# Altium schematic sheet LPDDR4X SDRAM.SchDoc: AS4C1G32MD4V-046BIN
size A4 portrait; DrawnBy: ThanhQuoc; Revision: V01; SheetNumber: 8; SheetTotal: 21; Project: RV1126 CAMERA BOARD DESIGN
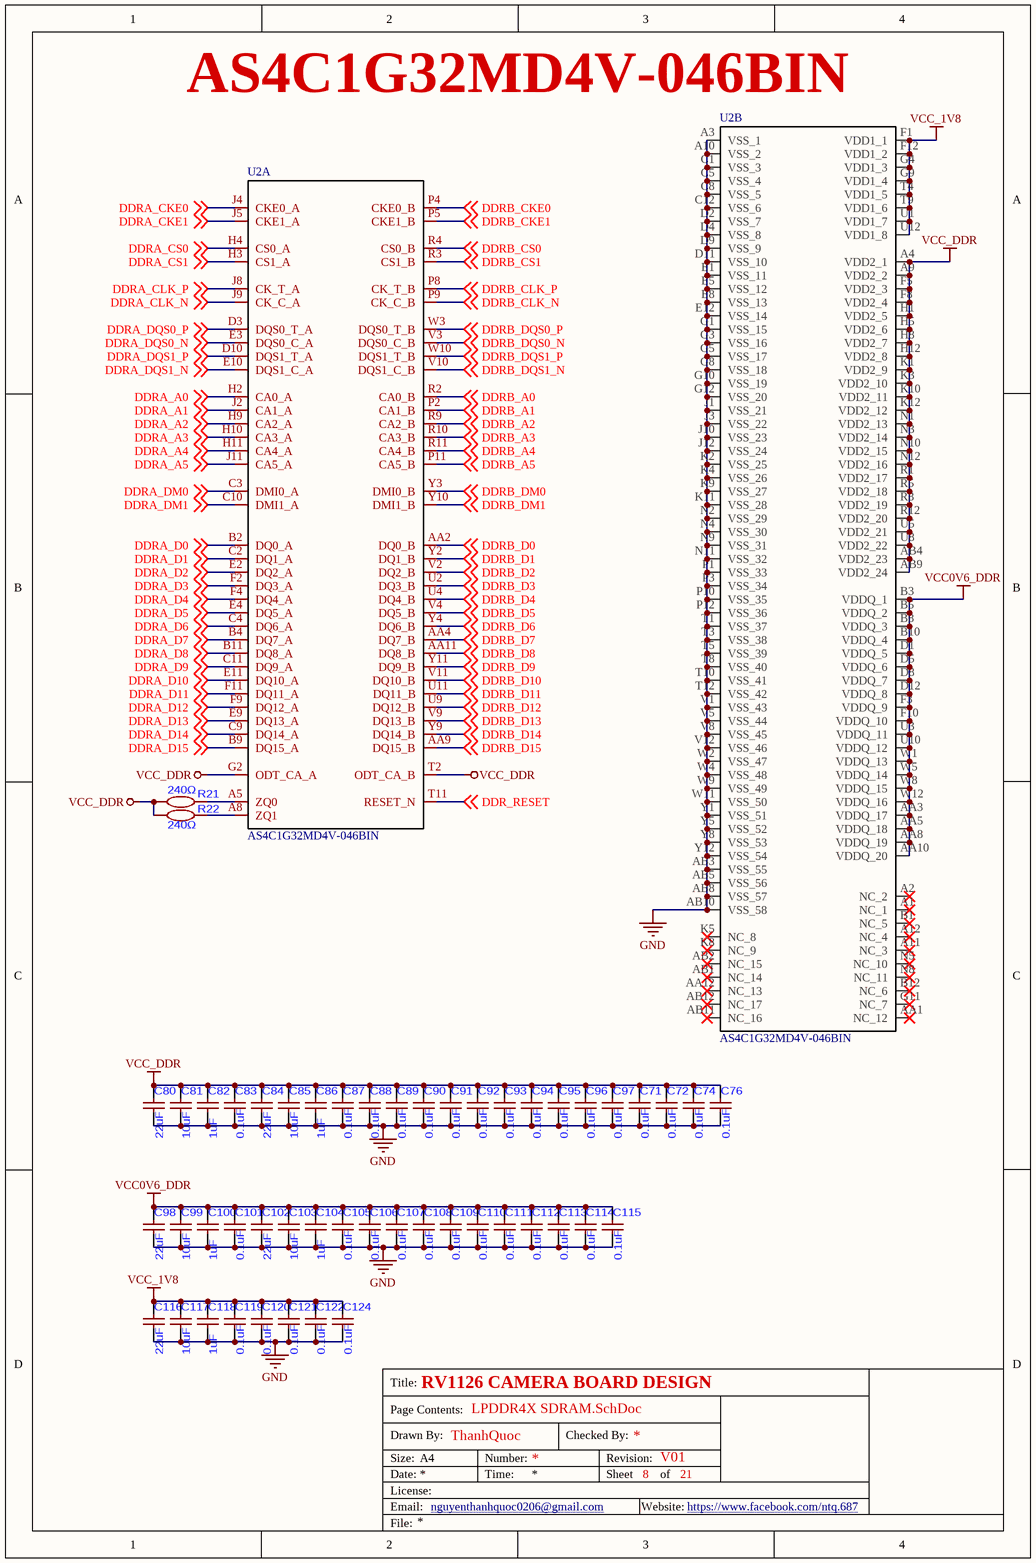
[diagram p0: LPDDR4X SDRAM.SchDoc]

## Parts
C71  0.1uF  [C0201]
C72  0.1uF  [C0201]
C74  0.1uF  [C0201]
C76  0.1uF  [C0201]
C80  22uF  [C0402]
C81  10uF  [C0402]
C82  1uF  [C0201]
C83  0.1uF  [C0201]
C84  22uF  [C0402]
C85  10uF  [C0402]
C86  1uF  [C0201]
C87  0.1uF  [C0201]
C88  0.1uF  [C0201]
C89  0.1uF  [C0201]
C90  0.1uF  [C0201]
C91  0.1uF  [C0201]
C92  0.1uF  [C0201]
C93  0.1uF  [C0201]
C94  0.1uF  [C0201]
C95  0.1uF  [C0201]
C96  0.1uF  [C0201]
C97  0.1uF  [C0201]
C98  22uF  [C0402]
C99  10uF  [C0402]
C100  1uF  [C0201]
C101  0.1uF  [C0201]
C102  22uF  [C0402]
C103  10uF  [C0402]
C104  1uF  [C0201]
C105  0.1uF  [C0201]
C106  0.1uF  [C0201]
C107  0.1uF  [C0201]
C108  0.1uF  [C0201]
C109  0.1uF  [C0201]
C110  0.1uF  [C0201]
C111  0.1uF  [C0201]
C112  0.1uF  [C0201]
C113  0.1uF  [C0201]
C114  0.1uF  [C0201]
C115  0.1uF  [C0201]
C116  22uF  [C0402]
C117  10uF  [C0402]
C118  1uF  [C0201]
C119  0.1uF  [C0201]
C120  0.1uF  [C0201]
C121  0.1uF  [C0201]
C122  0.1uF  [C0201]
C124  0.1uF  [C0201]
R21  240Ω  [R0201]
R22  240Ω  [R0201]
U2  AS4C1G32MD4V-046BIN  [BGA200C65P12X22_1000X1500X100]  (parts A,B of 2)

## Nets
GND: C71.1 C72.1 C74.1 C76.1 C80.1 C81.1 C82.1 C83.1 C84.1 C85.1 C86.1 C87.1 C88.1 C89.1 C90.1 C91.1 C92.1 C93.1 C94.1 C95.1 C96.1 C97.1 C98.1 C99.1 C100.1 C101.1 C102.1 C103.1 C104.1 C105.1 C106.1 C107.1 C108.1 C109.1 C110.1 C111.1 C112.1 C113.1 C114.1 C115.1 C116.1 C117.1 C118.1 C119.1 C120.1 C121.1 C122.1 C124.1 U2.A3(VSS_1) U2.A10(VSS_2) U2.AB3(VSS_55) U2.AB5(VSS_56) U2.AB8(VSS_57) U2.AB10(VSS_58) U2.C1(VSS_3) U2.C5(VSS_4) U2.C8(VSS_5) U2.C12(VSS_6) U2.D2(VSS_7) U2.D4(VSS_8) U2.D9(VSS_9) U2.D11(VSS_10) U2.E1(VSS_11) U2.E5(VSS_12) U2.E8(VSS_13) U2.E12(VSS_14) U2.G1(VSS_15) U2.G3(VSS_16) U2.G5(VSS_17) U2.G8(VSS_18) U2.G10(VSS_19) U2.G12(VSS_20) U2.J1(VSS_21) U2.J3(VSS_22) U2.J10(VSS_23) U2.J12(VSS_24) U2.K2(VSS_25) U2.K4(VSS_26) U2.K9(VSS_27) U2.K11(VSS_28) U2.N2(VSS_29) U2.N4(VSS_30) U2.N9(VSS_31) U2.N11(VSS_32) U2.P1(VSS_33) U2.P3(VSS_34) U2.P10(VSS_35) U2.P12(VSS_36) U2.T1(VSS_37) U2.T3(VSS_38) U2.T5(VSS_39) U2.T8(VSS_40) U2.T10(VSS_41) U2.T12(VSS_42) U2.V1(VSS_43) U2.V5(VSS_44) U2.V8(VSS_45) U2.V12(VSS_46) U2.W2(VSS_47) U2.W4(VSS_48) U2.W9(VSS_49) U2.W11(VSS_50) U2.Y1(VSS_51) U2.Y5(VSS_52) U2.Y8(VSS_53) U2.Y12(VSS_54)
VCC0V6_DDR: C98.2 C99.2 C100.2 C101.2 C102.2 C103.2 C104.2 C105.2 C106.2 C107.2 C108.2 C109.2 C110.2 C111.2 C112.2 C113.2 C114.2 C115.2 U2.AA3(VDDQ_17) U2.AA5(VDDQ_18) U2.AA8(VDDQ_19) U2.AA10(VDDQ_20) U2.B3(VDDQ_1) U2.B5(VDDQ_2) U2.B8(VDDQ_3) U2.B10(VDDQ_4) U2.D1(VDDQ_5) U2.D5(VDDQ_6) U2.D8(VDDQ_7) U2.D12(VDDQ_8) U2.F3(VDDQ_9) U2.F10(VDDQ_10) U2.U3(VDDQ_11) U2.U10(VDDQ_12) U2.W1(VDDQ_13) U2.W5(VDDQ_14) U2.W8(VDDQ_15) U2.W12(VDDQ_16)
VCC_1V8: C116.2 C117.2 C118.2 C119.2 C120.2 C121.2 C122.2 C124.2 U2.F1(VDD1_1) U2.F12(VDD1_2) U2.G4(VDD1_3) U2.G9(VDD1_4) U2.T4(VDD1_5) U2.T9(VDD1_6) U2.U1(VDD1_7) U2.U12(VDD1_8)
VCC_DDR: C71.2 C72.2 C74.2 C76.2 C80.2 C81.2 C82.2 C83.2 C84.2 C85.2 C86.2 C87.2 C88.2 C89.2 C90.2 C91.2 C92.2 C93.2 C94.2 C95.2 C96.2 C97.2 R21.1 R22.1 U2.A4(VDD2_1) U2.A9(VDD2_2) U2.AB4(VDD2_23) U2.AB9(VDD2_24) U2.F5(VDD2_3) U2.F8(VDD2_4) U2.G2(ODT_CA_A) U2.H1(VDD2_5) U2.H5(VDD2_6) U2.H8(VDD2_7) U2.H12(VDD2_8) U2.K1(VDD2_9) U2.K3(VDD2_10) U2.K10(VDD2_11) U2.K12(VDD2_12) U2.N1(VDD2_13) U2.N3(VDD2_14) U2.N10(VDD2_15) U2.N12(VDD2_16) U2.R1(VDD2_17) U2.R5(VDD2_18) U2.R8(VDD2_19) U2.R12(VDD2_20) U2.T2(ODT_CA_B) U2.U5(VDD2_21) U2.U8(VDD2_22)
DDR_RESET: U2.T11(RESET_N) ; off-sheet DDR_RESET
DDRA_A0: U2.H2(CA0_A) ; off-sheet DDRA_A0
DDRA_A1: U2.J2(CA1_A) ; off-sheet DDRA_A1
DDRA_A2: U2.H9(CA2_A) ; off-sheet DDRA_A2
DDRA_A3: U2.H10(CA3_A) ; off-sheet DDRA_A3
DDRA_A4: U2.H11(CA4_A) ; off-sheet DDRA_A4
DDRA_A5: U2.J11(CA5_A) ; off-sheet DDRA_A5
DDRA_CKE0: U2.J4(CKE0_A) ; off-sheet DDRA_CKE0
DDRA_CKE1: U2.J5(CKE1_A) ; off-sheet DDRA_CKE1
DDRA_CLK_N: U2.J9(CK_C_A) ; off-sheet DDRA_CLK_N
DDRA_CLK_P: U2.J8(CK_T_A) ; off-sheet DDRA_CLK_P
DDRA_CS0: U2.H4(CS0_A) ; off-sheet DDRA_CS0
DDRA_CS1: U2.H3(CS1_A) ; off-sheet DDRA_CS1
DDRA_D0: U2.B2(DQ0_A) ; off-sheet DDRA_D0
DDRA_D1: U2.C2(DQ1_A) ; off-sheet DDRA_D1
DDRA_D2: U2.E2(DQ2_A) ; off-sheet DDRA_D2
DDRA_D3: U2.F2(DQ3_A) ; off-sheet DDRA_D3
DDRA_D4: U2.F4(DQ4_A) ; off-sheet DDRA_D4
DDRA_D5: U2.E4(DQ5_A) ; off-sheet DDRA_D5
DDRA_D6: U2.C4(DQ6_A) ; off-sheet DDRA_D6
DDRA_D7: U2.B4(DQ7_A) ; off-sheet DDRA_D7
DDRA_D8: U2.B11(DQ8_A) ; off-sheet DDRA_D8
DDRA_D9: U2.C11(DQ9_A) ; off-sheet DDRA_D9
DDRA_D10: U2.E11(DQ10_A) ; off-sheet DDRA_D10
DDRA_D11: U2.F11(DQ11_A) ; off-sheet DDRA_D11
DDRA_D12: U2.F9(DQ12_A) ; off-sheet DDRA_D12
DDRA_D13: U2.E9(DQ13_A) ; off-sheet DDRA_D13
DDRA_D14: U2.C9(DQ14_A) ; off-sheet DDRA_D14
DDRA_D15: U2.B9(DQ15_A) ; off-sheet DDRA_D15
DDRA_DM0: U2.C3(DMI0_A) ; off-sheet DDRA_DM0
DDRA_DM1: U2.C10(DMI1_A) ; off-sheet DDRA_DM1
DDRA_DQS0_N: U2.E3(DQS0_C_A) ; off-sheet DDRA_DQS0_N
DDRA_DQS0_P: U2.D3(DQS0_T_A) ; off-sheet DDRA_DQS0_P
DDRA_DQS1_N: U2.E10(DQS1_C_A) ; off-sheet DDRA_DQS1_N
DDRA_DQS1_P: U2.D10(DQS1_T_A) ; off-sheet DDRA_DQS1_P
DDRB_A0: U2.R2(CA0_B) ; off-sheet DDRB_A0
DDRB_A1: U2.P2(CA1_B) ; off-sheet DDRB_A1
DDRB_A2: U2.R9(CA2_B) ; off-sheet DDRB_A2
DDRB_A3: U2.R10(CA3_B) ; off-sheet DDRB_A3
DDRB_A4: U2.R11(CA4_B) ; off-sheet DDRB_A4
DDRB_A5: U2.P11(CA5_B) ; off-sheet DDRB_A5
DDRB_CKE0: U2.P4(CKE0_B) ; off-sheet DDRB_CKE0
DDRB_CKE1: U2.P5(CKE1_B) ; off-sheet DDRB_CKE1
DDRB_CLK_N: U2.P9(CK_C_B) ; off-sheet DDRB_CLK_N
DDRB_CLK_P: U2.P8(CK_T_B) ; off-sheet DDRB_CLK_P
DDRB_CS0: U2.R4(CS0_B) ; off-sheet DDRB_CS0
DDRB_CS1: U2.R3(CS1_B) ; off-sheet DDRB_CS1
DDRB_D0: U2.AA2(DQ0_B) ; off-sheet DDRB_D0
DDRB_D1: U2.Y2(DQ1_B) ; off-sheet DDRB_D1
DDRB_D2: U2.V2(DQ2_B) ; off-sheet DDRB_D2
DDRB_D3: U2.U2(DQ3_B) ; off-sheet DDRB_D3
DDRB_D4: U2.U4(DQ4_B) ; off-sheet DDRB_D4
DDRB_D5: U2.V4(DQ5_B) ; off-sheet DDRB_D5
DDRB_D6: U2.Y4(DQ6_B) ; off-sheet DDRB_D6
DDRB_D7: U2.AA4(DQ7_B) ; off-sheet DDRB_D7
DDRB_D8: U2.AA11(DQ8_B) ; off-sheet DDRB_D8
DDRB_D9: U2.Y11(DQ9_B) ; off-sheet DDRB_D9
DDRB_D10: U2.V11(DQ10_B) ; off-sheet DDRB_D10
DDRB_D11: U2.U11(DQ11_B) ; off-sheet DDRB_D11
DDRB_D12: U2.U9(DQ12_B) ; off-sheet DDRB_D12
DDRB_D13: U2.V9(DQ13_B) ; off-sheet DDRB_D13
DDRB_D14: U2.Y9(DQ14_B) ; off-sheet DDRB_D14
DDRB_D15: U2.AA9(DQ15_B) ; off-sheet DDRB_D15
DDRB_DM0: U2.Y3(DMI0_B) ; off-sheet DDRB_DM0
DDRB_DM1: U2.Y10(DMI1_B) ; off-sheet DDRB_DM1
DDRB_DQS0_N: U2.V3(DQS0_C_B) ; off-sheet DDRB_DQS0_N
DDRB_DQS0_P: U2.W3(DQS0_T_B) ; off-sheet DDRB_DQS0_P
DDRB_DQS1_N: U2.V10(DQS1_C_B) ; off-sheet DDRB_DQS1_N
DDRB_DQS1_P: U2.W10(DQS1_T_B) ; off-sheet DDRB_DQS1_P
NetR21_2: R21.2 U2.A5(ZQ0)
NetR22_2: R22.2 U2.A8(ZQ1)

Not connected (* = marked no-connect by the designer): U2 A1(NC_1)* A2(NC_2)* A11(NC_3)* A12(NC_4)* AA1(NC_12)* AA12(NC_13)* AB1(NC_14)* AB2(NC_15)* AB11(NC_16)* AB12(NC_17)* B1(NC_5)* B12(NC_6)* G11(NC_7)* K5(NC_8)* K8(NC_9)* N5(NC_10)* N8(NC_11)*

## Notes on the sheet
- Title:
- Drawn By:
- Page Contents:
- Checked By:
- Size:
- Date:
- File:
- License:
- Email:
- A4
- nguyenthanhquoc0206@gmail.com
- Number:
- Time:
- Revision:
- Sheet
- Website:
- of
- https://www.facebook.com/ntq.687

## Library data of the parts
C71 C72 C74 C76 C83 C87-C97 C101 C105-C115 C119-C122 C124 = CAP_100nF-6.3V-10%-0201_1: 0.1uF ±10% 6.3V Ceramic Capacitor X5R 0201
C80 C84 C98 C102 C116 = CAP_22uF-6.3V-20%-0402: 22uF X5R ±20% 6.3V 0402 Ceramic Capacitors RoHS; ComponentLink1Description: LCSC; ComponentLink1URL: https://www.lcsc.com/product-detail/C385994.html?s_z=n_q_t_22UF&spm=wm.fly.bg.2.xh___wm.ssy.tc.2.tz&lcsc_vid=EwRWBFZSQVIPVFdUTlJfVldeFFRYUFQAElRYBFRRE1MxVlNeRFZbX1BRRVlbVDsOAxUeFF5JWBYZEEoKFBINSQcJGk4NBhADEA4cHktXRlhXSQwSGg0%3D
C81 C85 C99 C103 C117 = CAP_10uF-10V-20%-0402: 10µF ±20% 10V Ceramic Capacitor X5R 0402 (1005 Metric)
C82 C86 C100 C104 C118 = CAP_1uF-6.3V-10%-0201: 1uF ±10% 6.3V Ceramic Capacitor X5R 0201
R21 R22 = RES_240-0.063W-1%-0201: RES 240Ω ±1% 50mW 0201; ComponentLink1Description: LCSC; ComponentLink1URL: https://www.lcsc.com/product-detail/C155745.html?s_z=n_q_t_240%2520OHM&spm=wm.fly.bg.0.xh___wm.ssy.tc.0.tz&lcsc_vid=EwRWBFZSQVIPVFdUTlJfVldeFFRYUFQAElRYBFRRE1MxVlNeRFdWVFBQTlZbVTsOAxUeFF5JWBYZEEoKFBINSQcJGk4dAgUUFAk%3D
U2 = AS4C1G32MD4V-046BIN: DRAM LPDDR4X, 32Gb, 1G X 32, 0.6v, 200ball TFBGA,2133MHZ,industrial Temp; Manufacturer_Name: Alliance Memory; Geometry.Height: 1mm; Manufacturer_Part_Number: AS4C1G32MD4V-046BIN; Mouser Part Number: 913-AS4C1G32MD4046BI; Mouser Price/Stock: https://www.mouser.co.uk/ProductDetail/Alliance-Memory/AS4C1G32MD4V-046BIN?qs=2wMNvWM5ZX7JcOV9cKEgAg%3D%3D; Arrow Part Number: *; Arrow Price/Stock: *; Datasheet Link: https://www.alliancememory.com/wp-content/uploads/pdf/ddr4/AllianceMemory_8Gb_16Gb_32Gb_LPDDR4X_AS4C512M16MD4V_AS4C512M32MD4V_AS4C1G32MD4V.pdf